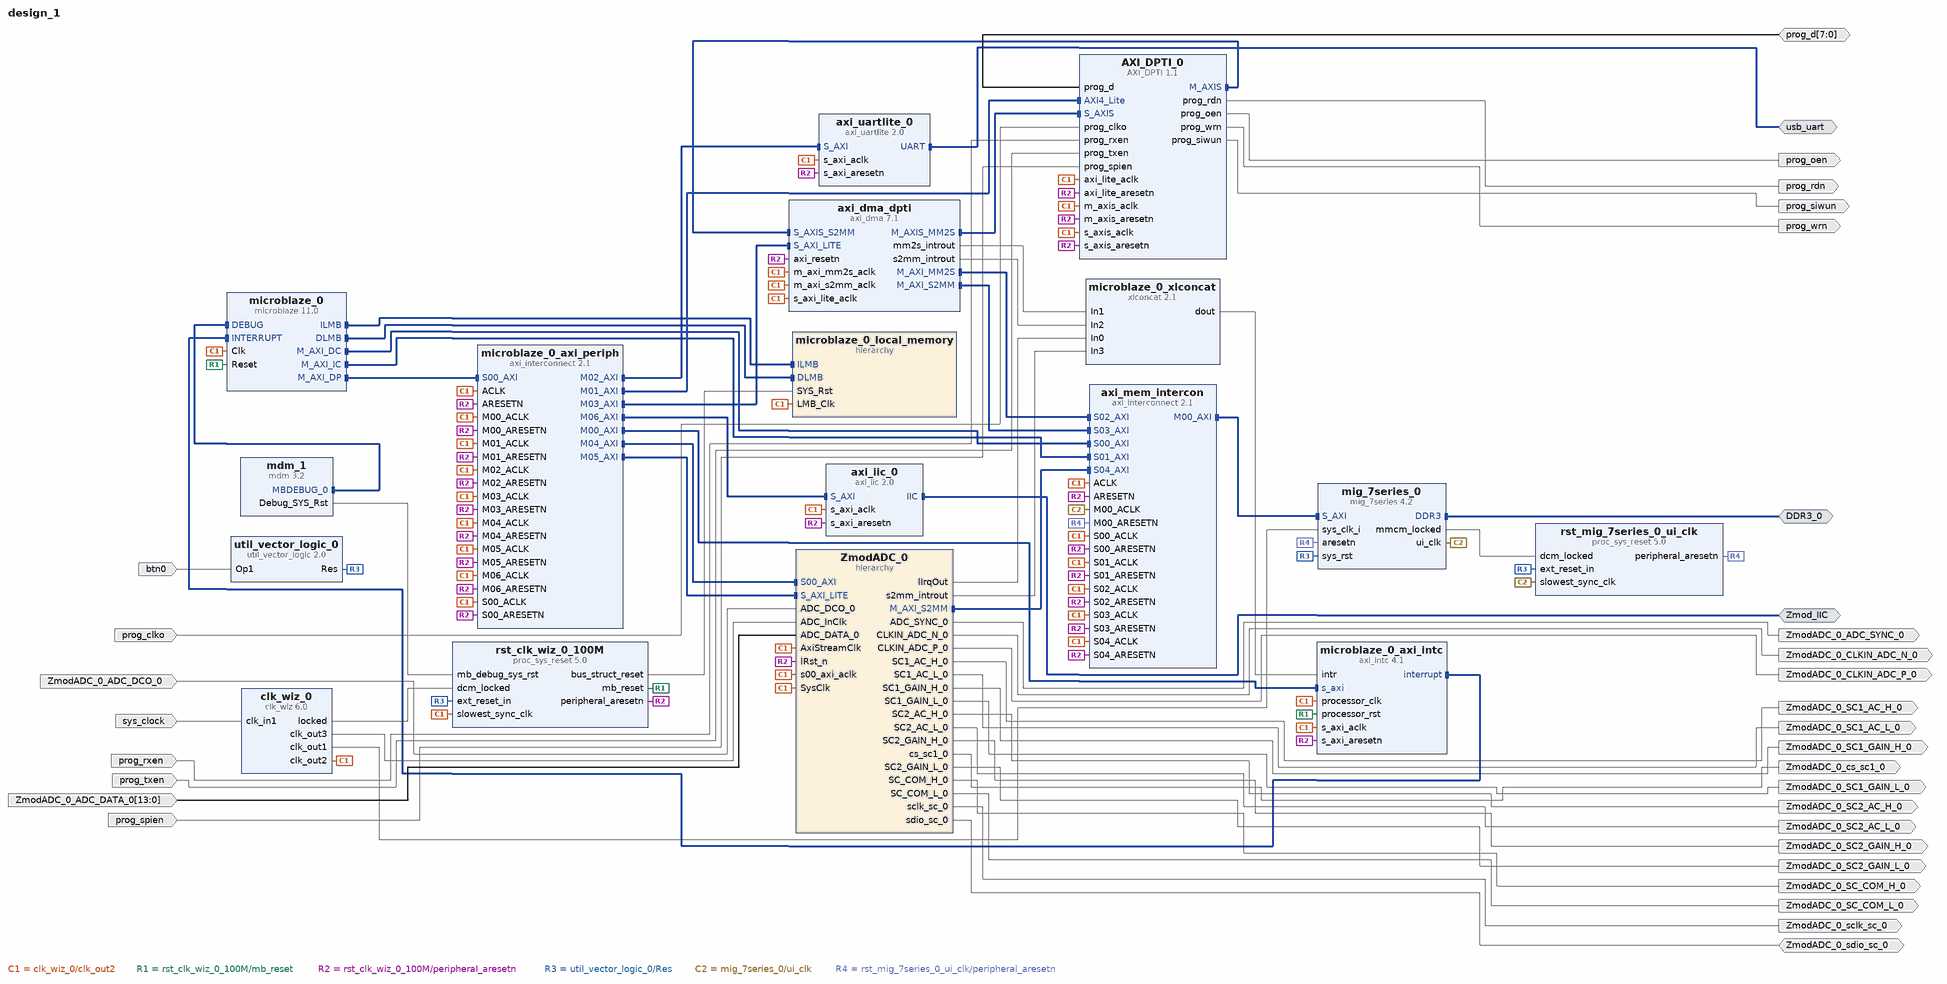
[diagram p0: block diagram of the top level]
# Vivado block design design_1, xc7a100tcsg324-1, Vivado 2019.1.3
create_bd_design design_1

create_bd_intf_port -mode Master -vlnv xilinx.com:interface:uart_rtl:1.0 usb_uart
create_bd_intf_port -mode Master -vlnv xilinx.com:interface:iic_rtl:1.0 Zmod_IIC
create_bd_intf_port -mode Master -vlnv xilinx.com:interface:ddrx_rtl:1.0 DDR3_0
create_bd_port -dir O ZmodADC_0_ADC_SYNC_0
create_bd_port -dir O ZmodADC_0_CLKIN_ADC_N_0
create_bd_port -dir O ZmodADC_0_CLKIN_ADC_P_0
create_bd_port -dir O ZmodADC_0_SC1_AC_H_0
create_bd_port -dir O ZmodADC_0_SC1_AC_L_0
create_bd_port -dir O ZmodADC_0_SC1_GAIN_H_0
create_bd_port -dir O ZmodADC_0_SC1_GAIN_L_0
create_bd_port -dir O ZmodADC_0_SC2_AC_H_0
create_bd_port -dir O ZmodADC_0_SC2_AC_L_0
create_bd_port -dir O ZmodADC_0_SC2_GAIN_H_0
create_bd_port -dir O ZmodADC_0_SC2_GAIN_L_0
create_bd_port -dir O ZmodADC_0_SC_COM_H_0
create_bd_port -dir O ZmodADC_0_SC_COM_L_0
create_bd_port -dir O ZmodADC_0_cs_sc1_0
create_bd_port -dir O ZmodADC_0_sclk_sc_0
create_bd_port -dir IO ZmodADC_0_sdio_sc_0
create_bd_port -dir I ZmodADC_0_ADC_DCO_0
create_bd_port -dir I -from 13 -to 0 ZmodADC_0_ADC_DATA_0
create_bd_port -dir O prog_rdn
create_bd_port -dir O prog_wrn
create_bd_port -dir O prog_oen
create_bd_port -dir O prog_siwun
create_bd_port -dir IO -from 7 -to 0 prog_d
create_bd_port -dir I prog_clko
create_bd_port -dir I prog_rxen
create_bd_port -dir I prog_txen
create_bd_port -dir I prog_spien
create_bd_port -dir I btn0
create_bd_port -dir I -type clk sys_clock
set_property -dict {CONFIG.FREQ_HZ 100000000 CONFIG.PHASE 0.000} [get_bd_ports sys_clock]

create_bd_cell -type ip -vlnv xilinx.com:ip:clk_wiz:6.0 clk_wiz_0
set_property -dict [list \
  CONFIG.CLKOUT1_JITTER 126.455 \
  CONFIG.CLKOUT1_PHASE_ERROR 114.212 \
  CONFIG.CLKOUT1_REQUESTED_OUT_FREQ 200.000 \
  CONFIG.CLKOUT2_JITTER 144.719 \
  CONFIG.CLKOUT2_PHASE_ERROR 114.212 \
  CONFIG.CLKOUT2_USED true \
  CONFIG.CLKOUT3_JITTER 111.164 \
  CONFIG.CLKOUT3_PHASE_ERROR 114.212 \
  CONFIG.CLKOUT3_REQUESTED_OUT_FREQ 400.000 \
  CONFIG.CLKOUT3_USED true \
  CONFIG.CLK_IN1_BOARD_INTERFACE sys_clock \
  CONFIG.MMCM_CLKFBOUT_MULT_F 8.000 \
  CONFIG.MMCM_CLKOUT0_DIVIDE_F 4.000 \
  CONFIG.MMCM_CLKOUT1_DIVIDE 8 \
  CONFIG.MMCM_CLKOUT2_DIVIDE 2 \
  CONFIG.NUM_OUT_CLKS 3 \
  CONFIG.USE_BOARD_FLOW true \
  CONFIG.USE_RESET false \
] [get_bd_cells clk_wiz_0]
create_bd_cell -type ip -vlnv xilinx.com:ip:microblaze:11.0 microblaze_0
set_property -dict [list \
  CONFIG.C_CACHE_BYTE_SIZE 8192 \
  CONFIG.C_DCACHE_BYTE_SIZE 8192 \
  CONFIG.C_DEBUG_ENABLED 1 \
  CONFIG.C_D_AXI 1 \
  CONFIG.C_D_LMB 1 \
  CONFIG.C_I_LMB 1 \
  CONFIG.C_USE_DCACHE 1 \
  CONFIG.C_USE_ICACHE 1 \
] [get_bd_cells microblaze_0]
create_bd_cell -type hier microblaze_0_local_memory
create_bd_cell -type ip -vlnv xilinx.com:ip:axi_interconnect:2.1 microblaze_0_axi_periph
set_property -dict {CONFIG.NUM_MI 7} [get_bd_cells microblaze_0_axi_periph]
create_bd_cell -type ip -vlnv xilinx.com:ip:axi_intc:4.1 microblaze_0_axi_intc
set_property -dict {CONFIG.C_HAS_FAST 1} [get_bd_cells microblaze_0_axi_intc]
create_bd_cell -type ip -vlnv xilinx.com:ip:xlconcat:2.1 microblaze_0_xlconcat
set_property -dict {CONFIG.NUM_PORTS 4} [get_bd_cells microblaze_0_xlconcat]
create_bd_cell -type ip -vlnv xilinx.com:ip:mdm:3.2 mdm_1
create_bd_cell -type ip -vlnv xilinx.com:ip:proc_sys_reset:5.0 rst_clk_wiz_0_100M
create_bd_cell -type ip -vlnv xilinx.com:ip:axi_interconnect:2.1 axi_mem_intercon
set_property -dict {CONFIG.NUM_MI 1 CONFIG.NUM_SI 5} [get_bd_cells axi_mem_intercon]
create_bd_cell -type hier ZmodADC_0
create_bd_cell -type ip -vlnv xilinx.com:ip:axi_uartlite:2.0 axi_uartlite_0
set_property -dict [list \
  CONFIG.C_BAUDRATE 115200 \
  CONFIG.UARTLITE_BOARD_INTERFACE usb_uart \
  CONFIG.USE_BOARD_FLOW true \
] [get_bd_cells axi_uartlite_0]
create_bd_cell -type ip -vlnv xilinx.com:ip:axi_dma:7.1 axi_dma_dpti
set_property -dict [list \
  CONFIG.c_include_mm2s_dre 1 \
  CONFIG.c_include_s2mm_dre 1 \
  CONFIG.c_include_sg 0 \
  CONFIG.c_sg_length_width 23 \
] [get_bd_cells axi_dma_dpti]
create_bd_cell -type ip -vlnv xilinx.com:ip:axi_iic:2.0 axi_iic_0
create_bd_cell -type ip -vlnv xilinx.com:ip:mig_7series:4.2 mig_7series_0
set_property -dict [list \
  CONFIG.BOARD_MIG_PARAM Custom \
  CONFIG.RESET_BOARD_INTERFACE Custom \
  CONFIG.XML_INPUT_FILE mig_a.prj \
] [get_bd_cells mig_7series_0]
create_bd_cell -type ip -vlnv xilinx.com:ip:proc_sys_reset:5.0 rst_mig_7series_0_ui_clk
create_bd_cell -type ip -vlnv xilinx.com:ip:util_vector_logic:2.0 util_vector_logic_0
set_property -dict {CONFIG.C_OPERATION not CONFIG.C_SIZE 1} [get_bd_cells util_vector_logic_0]
create_bd_cell -type ip -vlnv digilentinc.com:IP:AXI_DPTI:1.1 AXI_DPTI_0

# ---- hierarchy /microblaze_0_local_memory ----
current_bd_instance /microblaze_0_local_memory
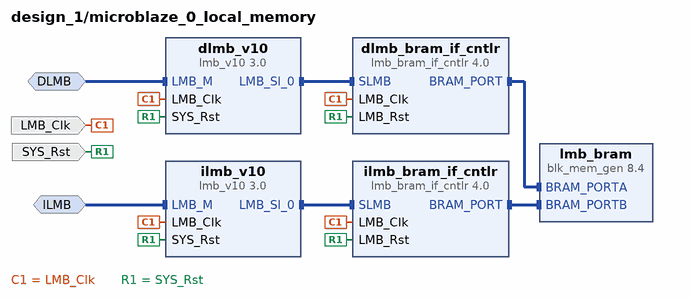
[diagram p1: block diagram inside /microblaze_0_local_memory]
create_bd_intf_pin -mode MirroredMaster -vlnv xilinx.com:interface:lmb_rtl:1.0 DLMB
create_bd_intf_pin -mode MirroredMaster -vlnv xilinx.com:interface:lmb_rtl:1.0 ILMB
create_bd_pin -dir I -type clk LMB_Clk
create_bd_pin -dir I -type rst SYS_Rst

create_bd_cell -type ip -vlnv xilinx.com:ip:lmb_v10:3.0 dlmb_v10
create_bd_cell -type ip -vlnv xilinx.com:ip:lmb_v10:3.0 ilmb_v10
create_bd_cell -type ip -vlnv xilinx.com:ip:lmb_bram_if_cntlr:4.0 dlmb_bram_if_cntlr
set_property -dict {CONFIG.C_ECC 0} [get_bd_cells dlmb_bram_if_cntlr]
create_bd_cell -type ip -vlnv xilinx.com:ip:lmb_bram_if_cntlr:4.0 ilmb_bram_if_cntlr
set_property -dict {CONFIG.C_ECC 0} [get_bd_cells ilmb_bram_if_cntlr]
create_bd_cell -type ip -vlnv xilinx.com:ip:blk_mem_gen:8.4 lmb_bram
set_property -dict {CONFIG.Memory_Type True_Dual_Port_RAM CONFIG.use_bram_block BRAM_Controller} [get_bd_cells lmb_bram]

# ---- hierarchy /ZmodADC_0 ----
current_bd_instance /ZmodADC_0
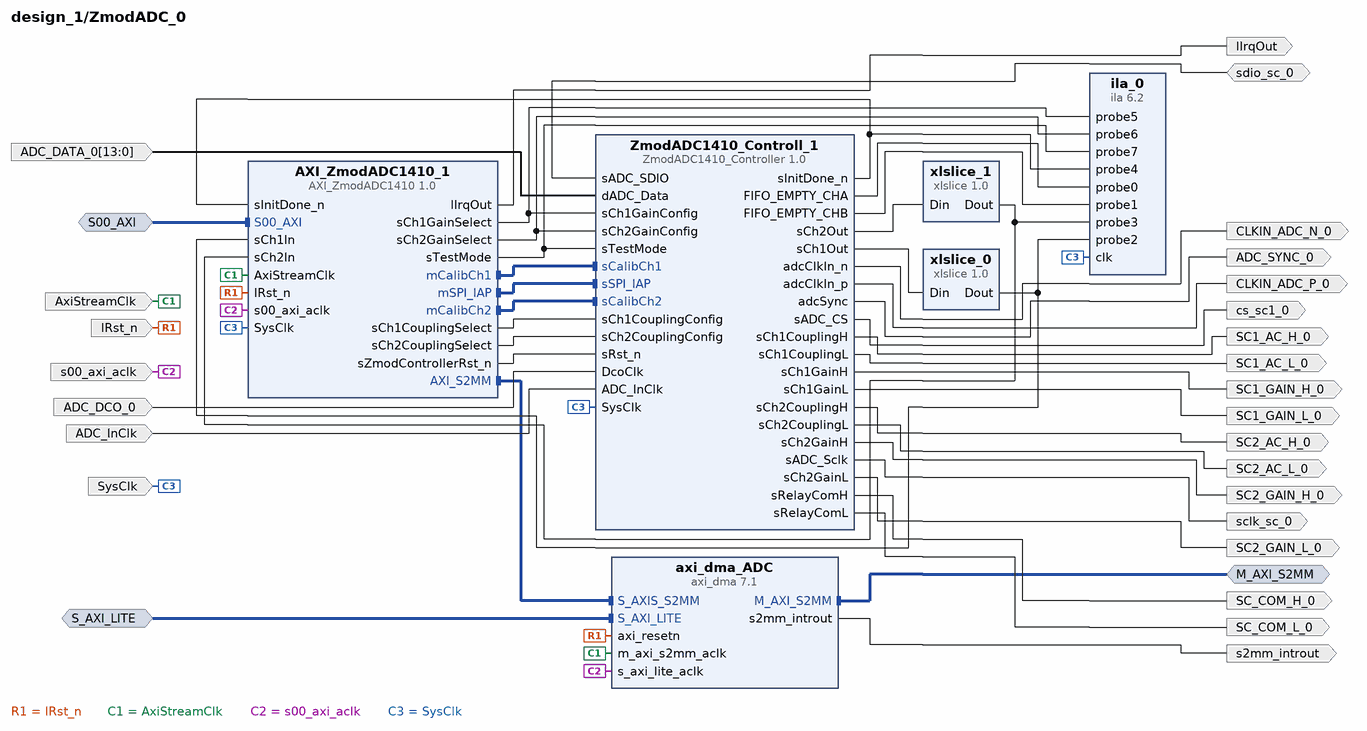
[diagram p2: block diagram inside /ZmodADC_0]
create_bd_intf_pin -mode Master -vlnv xilinx.com:interface:aximm_rtl:1.0 M_AXI_S2MM
create_bd_intf_pin -mode Slave -vlnv xilinx.com:interface:aximm_rtl:1.0 S00_AXI
create_bd_intf_pin -mode Slave -vlnv xilinx.com:interface:aximm_rtl:1.0 S_AXI_LITE
create_bd_pin -dir I -from 13 -to 0 ADC_DATA_0
create_bd_pin -dir I ADC_DCO_0
create_bd_pin -dir I -type clk ADC_InClk
create_bd_pin -dir O ADC_SYNC_0
create_bd_pin -dir I -type clk AxiStreamClk
create_bd_pin -dir O CLKIN_ADC_N_0
create_bd_pin -dir O CLKIN_ADC_P_0
create_bd_pin -dir O SC1_AC_H_0
create_bd_pin -dir O SC1_AC_L_0
create_bd_pin -dir O SC1_GAIN_H_0
create_bd_pin -dir O SC1_GAIN_L_0
create_bd_pin -dir O SC2_AC_H_0
create_bd_pin -dir O SC2_AC_L_0
create_bd_pin -dir O SC2_GAIN_H_0
create_bd_pin -dir O SC2_GAIN_L_0
create_bd_pin -dir O SC_COM_H_0
create_bd_pin -dir O SC_COM_L_0
create_bd_pin -dir I -type clk SysClk
create_bd_pin -dir O cs_sc1_0
create_bd_pin -dir O -type intr lIrqOut
create_bd_pin -dir I -type rst lRst_n
create_bd_pin -dir I -type clk s00_axi_aclk
create_bd_pin -dir O -type intr s2mm_introut
create_bd_pin -dir O sclk_sc_0
create_bd_pin -dir IO sdio_sc_0

create_bd_cell -type ip -vlnv xilinx.com:ip:axi_dma:7.1 axi_dma_ADC
set_property -dict {CONFIG.c_include_mm2s 0 CONFIG.c_include_sg 0 CONFIG.c_sg_length_width 18} [get_bd_cells axi_dma_ADC]
create_bd_cell -type ip -vlnv xilinx.com:ip:ila:6.2 ila_0
set_property -dict {CONFIG.C_ENABLE_ILA_AXI_MON false CONFIG.C_MONITOR_TYPE Native CONFIG.C_NUM_OF_PROBES 8} [get_bd_cells ila_0]
create_bd_cell -type ip -vlnv xilinx.com:ip:xlslice:1.0 xlslice_0
set_property -dict {CONFIG.DIN_FROM 15 CONFIG.DIN_TO 2 CONFIG.DIN_WIDTH 16 CONFIG.DOUT_WIDTH 14} [get_bd_cells xlslice_0]
create_bd_cell -type ip -vlnv xilinx.com:ip:xlslice:1.0 xlslice_1
set_property -dict {CONFIG.DIN_FROM 15 CONFIG.DIN_TO 2 CONFIG.DIN_WIDTH 16 CONFIG.DOUT_WIDTH 14} [get_bd_cells xlslice_1]
create_bd_cell -type ip -vlnv natinst.com:user:AXI_ZmodADC1410:1.0 AXI_ZmodADC1410_1
set_property -dict {CONFIG.kCrossRegCnt 13} [get_bd_cells AXI_ZmodADC1410_1]
create_bd_cell -type ip -vlnv xilinx.com:user:ZmodADC1410_Controller:1.0 ZmodADC1410_Controll_1
set_property -dict [list \
  CONFIG.kCh1HgMultCoefStatic {"000000000000000000"} \
  CONFIG.kCh1LgMultCoefStatic {"000000000000000000"} \
  CONFIG.kCh2HgMultCoefStatic {"000000000000000000"} \
  CONFIG.kCh2LgMultCoefStatic {"000000000000000000"} \
  CONFIG.kExtCmdInterfaceEn true \
  CONFIG.kExtRelayConfigEn true \
] [get_bd_cells ZmodADC1410_Controll_1]

# ---- connections ----

current_bd_instance /microblaze_0_local_memory
connect_bd_intf_net -intf_net microblaze_0_ilmb [get_bd_intf_pins ILMB] [get_bd_intf_pins ilmb_v10/LMB_M]
connect_bd_intf_net -intf_net microblaze_0_ilmb_cntlr [get_bd_intf_pins ilmb_bram_if_cntlr/BRAM_PORT] [get_bd_intf_pins lmb_bram/BRAM_PORTB]
connect_bd_intf_net -intf_net microblaze_0_dlmb [get_bd_intf_pins DLMB] [get_bd_intf_pins dlmb_v10/LMB_M]
connect_bd_intf_net -intf_net microblaze_0_dlmb_bus [get_bd_intf_pins dlmb_v10/LMB_Sl_0] [get_bd_intf_pins dlmb_bram_if_cntlr/SLMB]
connect_bd_intf_net -intf_net microblaze_0_dlmb_cntlr [get_bd_intf_pins dlmb_bram_if_cntlr/BRAM_PORT] [get_bd_intf_pins lmb_bram/BRAM_PORTA]
connect_bd_intf_net -intf_net microblaze_0_ilmb_bus [get_bd_intf_pins ilmb_v10/LMB_Sl_0] [get_bd_intf_pins ilmb_bram_if_cntlr/SLMB]
connect_bd_net -net microblaze_0_Clk [get_bd_pins LMB_Clk] \
  [get_bd_pins dlmb_v10/LMB_Clk] [get_bd_pins dlmb_bram_if_cntlr/LMB_Clk] [get_bd_pins ilmb_v10/LMB_Clk] \
  [get_bd_pins ilmb_bram_if_cntlr/LMB_Clk]
connect_bd_net [get_bd_pins SYS_Rst] \
  [get_bd_pins dlmb_v10/SYS_Rst] [get_bd_pins dlmb_bram_if_cntlr/LMB_Rst] [get_bd_pins ilmb_v10/SYS_Rst] \
  [get_bd_pins ilmb_bram_if_cntlr/LMB_Rst]
set_property HDL_ATTRIBUTE.BMM_INFO_ADDRESS_SPACE {byte  0x00000000 32 > design_1 microblaze_0_local_memory/lmb_bram} [get_bd_cells dlmb_bram_if_cntlr]
set_property HDL_ATTRIBUTE.KEEP_HIERARCHY yes [get_bd_cells dlmb_bram_if_cntlr]

current_bd_instance /ZmodADC_0
connect_bd_intf_net -intf_net axi_dma_0_M_AXI_S2MM [get_bd_intf_pins M_AXI_S2MM] [get_bd_intf_pins axi_dma_ADC/M_AXI_S2MM]
connect_bd_intf_net [get_bd_intf_pins S00_AXI] [get_bd_intf_pins AXI_ZmodADC1410_1/S00_AXI]
connect_bd_intf_net [get_bd_intf_pins AXI_ZmodADC1410_1/mCalibCh1] [get_bd_intf_pins ZmodADC1410_Controll_1/sCalibCh1]
connect_bd_intf_net [get_bd_intf_pins S_AXI_LITE] [get_bd_intf_pins axi_dma_ADC/S_AXI_LITE]
connect_bd_intf_net [get_bd_intf_pins AXI_ZmodADC1410_1/AXI_S2MM] [get_bd_intf_pins axi_dma_ADC/S_AXIS_S2MM]
connect_bd_intf_net -intf_net AXI_ZmodADC1410_1_mSPI [get_bd_intf_pins AXI_ZmodADC1410_1/mSPI_IAP] [get_bd_intf_pins ZmodADC1410_Controll_1/sSPI_IAP]
connect_bd_intf_net [get_bd_intf_pins AXI_ZmodADC1410_1/mCalibCh2] [get_bd_intf_pins ZmodADC1410_Controll_1/sCalibCh2]
connect_bd_net -net ADC_DATA_0_1 [get_bd_pins ADC_DATA_0] [get_bd_pins ZmodADC1410_Controll_1/dADC_Data]
connect_bd_net -net ADC_DCO_0_1 [get_bd_pins ADC_DCO_0] [get_bd_pins ZmodADC1410_Controll_1/DcoClk]
connect_bd_net [get_bd_pins AXI_ZmodADC1410_1/lIrqOut] [get_bd_pins lIrqOut]
connect_bd_net [get_bd_pins AXI_ZmodADC1410_1/sCh1CouplingSelect] [get_bd_pins ZmodADC1410_Controll_1/sCh1CouplingConfig]
connect_bd_net [get_bd_pins AXI_ZmodADC1410_1/sCh1GainSelect] [get_bd_pins ila_0/probe5] [get_bd_pins ZmodADC1410_Controll_1/sCh1GainConfig]
connect_bd_net [get_bd_pins AXI_ZmodADC1410_1/sCh2CouplingSelect] [get_bd_pins ZmodADC1410_Controll_1/sCh2CouplingConfig]
connect_bd_net [get_bd_pins AXI_ZmodADC1410_1/sCh2GainSelect] [get_bd_pins ila_0/probe6] [get_bd_pins ZmodADC1410_Controll_1/sCh2GainConfig]
connect_bd_net [get_bd_pins AXI_ZmodADC1410_1/sTestMode] [get_bd_pins ila_0/probe7] [get_bd_pins ZmodADC1410_Controll_1/sTestMode]
connect_bd_net [get_bd_pins AXI_ZmodADC1410_1/sZmodControllerRst_n] [get_bd_pins ZmodADC1410_Controll_1/sRst_n]
connect_bd_net [get_bd_pins sdio_sc_0] [get_bd_pins ZmodADC1410_Controll_1/sADC_SDIO]
connect_bd_net -net S00_ARESETN_1 [get_bd_pins lRst_n] [get_bd_pins axi_dma_ADC/axi_resetn] [get_bd_pins AXI_ZmodADC1410_1/lRst_n]
connect_bd_net -net ZmodADC1410_Controll_0_CALIB_DONE_N [get_bd_pins ZmodADC1410_Controll_1/sInitDone_n] \
  [get_bd_pins ila_0/probe4] [get_bd_pins AXI_ZmodADC1410_1/sInitDone_n]
connect_bd_net [get_bd_pins ZmodADC1410_Controll_1/FIFO_EMPTY_CHA] [get_bd_pins ila_0/probe0]
connect_bd_net [get_bd_pins ZmodADC1410_Controll_1/FIFO_EMPTY_CHB] [get_bd_pins ila_0/probe1]
connect_bd_net [get_bd_pins ZmodADC1410_Controll_1/adcClkIn_n] [get_bd_pins CLKIN_ADC_N_0]
connect_bd_net [get_bd_pins ZmodADC1410_Controll_1/adcClkIn_p] [get_bd_pins CLKIN_ADC_P_0]
connect_bd_net [get_bd_pins ZmodADC1410_Controll_1/adcSync] [get_bd_pins ADC_SYNC_0]
connect_bd_net [get_bd_pins ZmodADC1410_Controll_1/sADC_CS] [get_bd_pins cs_sc1_0]
connect_bd_net [get_bd_pins ZmodADC1410_Controll_1/sADC_Sclk] [get_bd_pins sclk_sc_0]
connect_bd_net [get_bd_pins ZmodADC1410_Controll_1/sCh1CouplingH] [get_bd_pins SC1_AC_H_0]
connect_bd_net [get_bd_pins ZmodADC1410_Controll_1/sCh1CouplingL] [get_bd_pins SC1_AC_L_0]
connect_bd_net [get_bd_pins ZmodADC1410_Controll_1/sCh1GainH] [get_bd_pins SC1_GAIN_H_0]
connect_bd_net [get_bd_pins ZmodADC1410_Controll_1/sCh1GainL] [get_bd_pins SC1_GAIN_L_0]
connect_bd_net [get_bd_pins ZmodADC1410_Controll_1/sCh1Out] [get_bd_pins xlslice_0/Din]
connect_bd_net [get_bd_pins ZmodADC1410_Controll_1/sCh2CouplingH] [get_bd_pins SC2_AC_H_0]
connect_bd_net [get_bd_pins ZmodADC1410_Controll_1/sCh2CouplingL] [get_bd_pins SC2_AC_L_0]
connect_bd_net [get_bd_pins ZmodADC1410_Controll_1/sCh2GainH] [get_bd_pins SC2_GAIN_H_0]
connect_bd_net [get_bd_pins ZmodADC1410_Controll_1/sCh2GainL] [get_bd_pins SC2_GAIN_L_0]
connect_bd_net [get_bd_pins ZmodADC1410_Controll_1/sCh2Out] [get_bd_pins xlslice_1/Din]
connect_bd_net [get_bd_pins ZmodADC1410_Controll_1/sRelayComH] [get_bd_pins SC_COM_H_0]
connect_bd_net [get_bd_pins ZmodADC1410_Controll_1/sRelayComL] [get_bd_pins SC_COM_L_0]
connect_bd_net -net axi_dma_0_s2mm_introut [get_bd_pins axi_dma_ADC/s2mm_introut] [get_bd_pins s2mm_introut]
connect_bd_net -net clk_wiz_0_clk_out1 [get_bd_pins AxiStreamClk] \
  [get_bd_pins axi_dma_ADC/m_axi_s2mm_aclk] [get_bd_pins AXI_ZmodADC1410_1/AxiStreamClk]
connect_bd_net -net clk_wiz_0_clk_out2 [get_bd_pins s00_axi_aclk] \
  [get_bd_pins axi_dma_ADC/s_axi_lite_aclk] [get_bd_pins AXI_ZmodADC1410_1/s00_axi_aclk]
connect_bd_net -net clk_wiz_0_clk_out4 [get_bd_pins ADC_InClk] [get_bd_pins ZmodADC1410_Controll_1/ADC_InClk]
connect_bd_net -net processing_system7_0_FCLK_CLK0 [get_bd_pins SysClk] \
  [get_bd_pins ila_0/clk] [get_bd_pins AXI_ZmodADC1410_1/SysClk] [get_bd_pins ZmodADC1410_Controll_1/SysClk]
connect_bd_net [get_bd_pins xlslice_0/Dout] [get_bd_pins ila_0/probe2] [get_bd_pins AXI_ZmodADC1410_1/sCh1In]
connect_bd_net [get_bd_pins xlslice_1/Dout] [get_bd_pins ila_0/probe3] [get_bd_pins AXI_ZmodADC1410_1/sCh2In]

current_bd_instance /
connect_bd_intf_net [get_bd_intf_ports DDR3_0] [get_bd_intf_pins mig_7series_0/DDR3]
connect_bd_intf_net [get_bd_intf_pins microblaze_0_axi_periph/M01_AXI] [get_bd_intf_pins AXI_DPTI_0/AXI4_Lite]
connect_bd_intf_net [get_bd_intf_pins microblaze_0_axi_periph/M04_AXI] [get_bd_intf_pins ZmodADC_0/S00_AXI]
connect_bd_intf_net [get_bd_intf_pins microblaze_0/ILMB] [get_bd_intf_pins microblaze_0_local_memory/ILMB]
connect_bd_intf_net -intf_net microblaze_0_intc_axi [get_bd_intf_pins microblaze_0_axi_periph/M00_AXI] [get_bd_intf_pins microblaze_0_axi_intc/s_axi]
connect_bd_intf_net [get_bd_intf_pins microblaze_0/M_AXI_DC] [get_bd_intf_pins axi_mem_intercon/S00_AXI]
connect_bd_intf_net [get_bd_intf_pins microblaze_0_axi_periph/M06_AXI] [get_bd_intf_pins axi_iic_0/S_AXI]
connect_bd_intf_net [get_bd_intf_pins microblaze_0_axi_periph/M05_AXI] [get_bd_intf_pins ZmodADC_0/S_AXI_LITE]
connect_bd_intf_net [get_bd_intf_pins microblaze_0/DLMB] [get_bd_intf_pins microblaze_0_local_memory/DLMB]
connect_bd_intf_net [get_bd_intf_pins microblaze_0_axi_intc/interrupt] [get_bd_intf_pins microblaze_0/INTERRUPT]
connect_bd_intf_net [get_bd_intf_pins axi_mem_intercon/M00_AXI] [get_bd_intf_pins mig_7series_0/S_AXI]
connect_bd_intf_net [get_bd_intf_ports usb_uart] [get_bd_intf_pins axi_uartlite_0/UART]
connect_bd_intf_net [get_bd_intf_pins microblaze_0/M_AXI_IC] [get_bd_intf_pins axi_mem_intercon/S01_AXI]
connect_bd_intf_net [get_bd_intf_pins ZmodADC_0/M_AXI_S2MM] [get_bd_intf_pins axi_mem_intercon/S04_AXI]
connect_bd_intf_net [get_bd_intf_pins mdm_1/MBDEBUG_0] [get_bd_intf_pins microblaze_0/DEBUG]
connect_bd_intf_net [get_bd_intf_pins axi_dma_dpti/M_AXIS_MM2S] [get_bd_intf_pins AXI_DPTI_0/S_AXIS]
connect_bd_intf_net [get_bd_intf_pins microblaze_0_axi_periph/M02_AXI] [get_bd_intf_pins axi_uartlite_0/S_AXI]
connect_bd_intf_net -intf_net microblaze_0_axi_dp [get_bd_intf_pins microblaze_0_axi_periph/S00_AXI] [get_bd_intf_pins microblaze_0/M_AXI_DP]
connect_bd_intf_net [get_bd_intf_pins microblaze_0_axi_periph/M03_AXI] [get_bd_intf_pins axi_dma_dpti/S_AXI_LITE]
connect_bd_intf_net [get_bd_intf_pins axi_dma_dpti/M_AXI_MM2S] [get_bd_intf_pins axi_mem_intercon/S02_AXI]
connect_bd_intf_net [get_bd_intf_pins axi_dma_dpti/M_AXI_S2MM] [get_bd_intf_pins axi_mem_intercon/S03_AXI]
connect_bd_intf_net [get_bd_intf_ports Zmod_IIC] [get_bd_intf_pins axi_iic_0/IIC]
connect_bd_intf_net [get_bd_intf_pins AXI_DPTI_0/M_AXIS] [get_bd_intf_pins axi_dma_dpti/S_AXIS_S2MM]
connect_bd_net -net microblaze_0_intr [get_bd_pins microblaze_0_xlconcat/dout] [get_bd_pins microblaze_0_axi_intc/intr]
connect_bd_net -net microblaze_0_Clk [get_bd_pins clk_wiz_0/clk_out2] \
  [get_bd_pins microblaze_0/Clk] [get_bd_pins microblaze_0_axi_periph/ACLK] [get_bd_pins microblaze_0_axi_periph/S00_ACLK] \
  [get_bd_pins microblaze_0_axi_periph/M00_ACLK] [get_bd_pins microblaze_0_axi_intc/s_axi_aclk] \
  [get_bd_pins microblaze_0_axi_intc/processor_clk] [get_bd_pins microblaze_0_local_memory/LMB_Clk] \
  [get_bd_pins rst_clk_wiz_0_100M/slowest_sync_clk] [get_bd_pins axi_mem_intercon/S00_ACLK] \
  [get_bd_pins axi_mem_intercon/ACLK] [get_bd_pins axi_mem_intercon/S01_ACLK] [get_bd_pins microblaze_0_axi_periph/M01_ACLK] \
  [get_bd_pins axi_uartlite_0/s_axi_aclk] [get_bd_pins microblaze_0_axi_periph/M02_ACLK] \
  [get_bd_pins axi_dma_dpti/s_axi_lite_aclk] [get_bd_pins microblaze_0_axi_periph/M03_ACLK] \
  [get_bd_pins ZmodADC_0/s00_axi_aclk] [get_bd_pins microblaze_0_axi_periph/M04_ACLK] \
  [get_bd_pins microblaze_0_axi_periph/M05_ACLK] [get_bd_pins ZmodADC_0/SysClk] [get_bd_pins axi_iic_0/s_axi_aclk] \
  [get_bd_pins microblaze_0_axi_periph/M06_ACLK] [get_bd_pins axi_mem_intercon/S02_ACLK] \
  [get_bd_pins axi_dma_dpti/m_axi_mm2s_aclk] [get_bd_pins axi_mem_intercon/S03_ACLK] \
  [get_bd_pins axi_dma_dpti/m_axi_s2mm_aclk] [get_bd_pins axi_mem_intercon/S04_ACLK] [get_bd_pins ZmodADC_0/AxiStreamClk] \
  [get_bd_pins AXI_DPTI_0/m_axis_aclk] [get_bd_pins AXI_DPTI_0/s_axis_aclk] [get_bd_pins AXI_DPTI_0/axi_lite_aclk]
connect_bd_net [get_bd_pins clk_wiz_0/locked] [get_bd_pins rst_clk_wiz_0_100M/dcm_locked]
connect_bd_net [get_bd_pins rst_clk_wiz_0_100M/mb_reset] [get_bd_pins microblaze_0/Reset] [get_bd_pins microblaze_0_axi_intc/processor_rst]
connect_bd_net [get_bd_pins rst_clk_wiz_0_100M/bus_struct_reset] [get_bd_pins microblaze_0_local_memory/SYS_Rst]
connect_bd_net [get_bd_pins rst_clk_wiz_0_100M/peripheral_aresetn] \
  [get_bd_pins microblaze_0_axi_periph/ARESETN] [get_bd_pins microblaze_0_axi_periph/S00_ARESETN] \
  [get_bd_pins microblaze_0_axi_periph/M00_ARESETN] [get_bd_pins microblaze_0_axi_intc/s_axi_aresetn] \
  [get_bd_pins axi_mem_intercon/S00_ARESETN] [get_bd_pins axi_mem_intercon/ARESETN] \
  [get_bd_pins microblaze_0_axi_periph/M01_ARESETN] [get_bd_pins axi_uartlite_0/s_axi_aresetn] \
  [get_bd_pins microblaze_0_axi_periph/M02_ARESETN] [get_bd_pins axi_dma_dpti/axi_resetn] \
  [get_bd_pins microblaze_0_axi_periph/M03_ARESETN] [get_bd_pins ZmodADC_0/lRst_n] \
  [get_bd_pins microblaze_0_axi_periph/M04_ARESETN] [get_bd_pins microblaze_0_axi_periph/M05_ARESETN] \
  [get_bd_pins axi_iic_0/s_axi_aresetn] [get_bd_pins microblaze_0_axi_periph/M06_ARESETN] \
  [get_bd_pins axi_mem_intercon/S01_ARESETN] [get_bd_pins axi_mem_intercon/S02_ARESETN] \
  [get_bd_pins axi_mem_intercon/S03_ARESETN] [get_bd_pins axi_mem_intercon/S04_ARESETN] \
  [get_bd_pins AXI_DPTI_0/m_axis_aresetn] [get_bd_pins AXI_DPTI_0/s_axis_aresetn] [get_bd_pins AXI_DPTI_0/axi_lite_aresetn]
connect_bd_net [get_bd_pins mdm_1/Debug_SYS_Rst] [get_bd_pins rst_clk_wiz_0_100M/mb_debug_sys_rst]
connect_bd_net [get_bd_pins ZmodADC_0/ADC_SYNC_0] [get_bd_ports ZmodADC_0_ADC_SYNC_0]
connect_bd_net [get_bd_pins ZmodADC_0/CLKIN_ADC_N_0] [get_bd_ports ZmodADC_0_CLKIN_ADC_N_0]
connect_bd_net [get_bd_pins ZmodADC_0/CLKIN_ADC_P_0] [get_bd_ports ZmodADC_0_CLKIN_ADC_P_0]
connect_bd_net [get_bd_pins ZmodADC_0/SC1_AC_H_0] [get_bd_ports ZmodADC_0_SC1_AC_H_0]
connect_bd_net [get_bd_pins ZmodADC_0/SC1_AC_L_0] [get_bd_ports ZmodADC_0_SC1_AC_L_0]
connect_bd_net [get_bd_pins ZmodADC_0/SC1_GAIN_H_0] [get_bd_ports ZmodADC_0_SC1_GAIN_H_0]
connect_bd_net [get_bd_pins ZmodADC_0/SC1_GAIN_L_0] [get_bd_ports ZmodADC_0_SC1_GAIN_L_0]
connect_bd_net [get_bd_pins ZmodADC_0/SC2_AC_H_0] [get_bd_ports ZmodADC_0_SC2_AC_H_0]
connect_bd_net [get_bd_pins ZmodADC_0/SC2_AC_L_0] [get_bd_ports ZmodADC_0_SC2_AC_L_0]
connect_bd_net [get_bd_pins ZmodADC_0/SC2_GAIN_H_0] [get_bd_ports ZmodADC_0_SC2_GAIN_H_0]
connect_bd_net [get_bd_pins ZmodADC_0/SC2_GAIN_L_0] [get_bd_ports ZmodADC_0_SC2_GAIN_L_0]
connect_bd_net [get_bd_pins ZmodADC_0/SC_COM_H_0] [get_bd_ports ZmodADC_0_SC_COM_H_0]
connect_bd_net [get_bd_pins ZmodADC_0/SC_COM_L_0] [get_bd_ports ZmodADC_0_SC_COM_L_0]
connect_bd_net [get_bd_pins ZmodADC_0/cs_sc1_0] [get_bd_ports ZmodADC_0_cs_sc1_0]
connect_bd_net [get_bd_pins ZmodADC_0/sclk_sc_0] [get_bd_ports ZmodADC_0_sclk_sc_0]
connect_bd_net [get_bd_ports ZmodADC_0_sdio_sc_0] [get_bd_pins ZmodADC_0/sdio_sc_0]
connect_bd_net -net ZmodADC_0_ADC_DCO_0_1 [get_bd_ports ZmodADC_0_ADC_DCO_0] [get_bd_pins ZmodADC_0/ADC_DCO_0]
connect_bd_net -net ZmodADC_0_ADC_DATA_0_1 [get_bd_ports ZmodADC_0_ADC_DATA_0] [get_bd_pins ZmodADC_0/ADC_DATA_0]
connect_bd_net [get_bd_pins AXI_DPTI_0/prog_rdn] [get_bd_ports prog_rdn]
connect_bd_net [get_bd_pins AXI_DPTI_0/prog_wrn] [get_bd_ports prog_wrn]
connect_bd_net [get_bd_pins AXI_DPTI_0/prog_oen] [get_bd_ports prog_oen]
connect_bd_net [get_bd_pins AXI_DPTI_0/prog_siwun] [get_bd_ports prog_siwun]
connect_bd_net [get_bd_ports prog_d] [get_bd_pins AXI_DPTI_0/prog_d]
connect_bd_net -net prog_clko_0_1 [get_bd_ports prog_clko] [get_bd_pins AXI_DPTI_0/prog_clko]
connect_bd_net -net prog_rxen_0_1 [get_bd_ports prog_rxen] [get_bd_pins AXI_DPTI_0/prog_rxen]
connect_bd_net -net prog_txen_0_1 [get_bd_ports prog_txen] [get_bd_pins AXI_DPTI_0/prog_txen]
connect_bd_net -net prog_spien_0_1 [get_bd_ports prog_spien] [get_bd_pins AXI_DPTI_0/prog_spien]
connect_bd_net -net btn0_1 [get_bd_pins util_vector_logic_0/Res] \
  [get_bd_pins rst_clk_wiz_0_100M/ext_reset_in] [get_bd_pins rst_mig_7series_0_ui_clk/ext_reset_in] \
  [get_bd_pins mig_7series_0/sys_rst]
connect_bd_net [get_bd_pins ZmodADC_0/lIrqOut] [get_bd_pins microblaze_0_xlconcat/In0]
connect_bd_net [get_bd_pins axi_dma_dpti/mm2s_introut] [get_bd_pins microblaze_0_xlconcat/In1]
connect_bd_net [get_bd_pins axi_dma_dpti/s2mm_introut] [get_bd_pins microblaze_0_xlconcat/In2]
connect_bd_net [get_bd_pins clk_wiz_0/clk_out3] [get_bd_pins ZmodADC_0/ADC_InClk]
connect_bd_net [get_bd_ports sys_clock] [get_bd_pins clk_wiz_0/clk_in1]
connect_bd_net [get_bd_pins clk_wiz_0/clk_out1] [get_bd_pins mig_7series_0/sys_clk_i]
connect_bd_net [get_bd_pins mig_7series_0/ui_clk] [get_bd_pins axi_mem_intercon/M00_ACLK] [get_bd_pins rst_mig_7series_0_ui_clk/slowest_sync_clk]
connect_bd_net [get_bd_pins mig_7series_0/mmcm_locked] [get_bd_pins rst_mig_7series_0_ui_clk/dcm_locked]
connect_bd_net [get_bd_pins rst_mig_7series_0_ui_clk/peripheral_aresetn] \
  [get_bd_pins axi_mem_intercon/M00_ARESETN] [get_bd_pins mig_7series_0/aresetn]
connect_bd_net [get_bd_pins ZmodADC_0/s2mm_introut] [get_bd_pins microblaze_0_xlconcat/In3]
connect_bd_net -net btn0_2 [get_bd_ports btn0] [get_bd_pins util_vector_logic_0/Op1]
set_property HDL_ATTRIBUTE.BMM_INFO_PROCESSOR {microblaze-le > design_1 microblaze_0_local_memory/dlmb_bram_if_cntlr} [get_bd_cells microblaze_0]
set_property HDL_ATTRIBUTE.KEEP_HIERARCHY yes [get_bd_cells microblaze_0]

# ---- address map ----
assign_bd_address -offset 0x80000000 -range 512M -target_address_space [get_bd_addr_spaces axi_dma_dpti/Data_MM2S] [get_bd_addr_segs mig_7series_0/memmap/memaddr]
assign_bd_address -offset 0x80000000 -range 512M -target_address_space [get_bd_addr_spaces axi_dma_dpti/Data_S2MM] [get_bd_addr_segs mig_7series_0/memmap/memaddr]
assign_bd_address -offset 0x00000000 -range 32K -target_address_space [get_bd_addr_spaces microblaze_0/Data] [get_bd_addr_segs microblaze_0_local_memory/dlmb_bram_if_cntlr/SLMB/Mem]
assign_bd_address -offset 0x40600000 -range 64K -target_address_space [get_bd_addr_spaces microblaze_0/Data] [get_bd_addr_segs axi_uartlite_0/S_AXI/Reg]
assign_bd_address -offset 0x40800000 -range 64K -target_address_space [get_bd_addr_spaces microblaze_0/Data] [get_bd_addr_segs axi_iic_0/S_AXI/Reg]
assign_bd_address -offset 0x41200000 -range 64K -target_address_space [get_bd_addr_spaces microblaze_0/Data] [get_bd_addr_segs microblaze_0_axi_intc/S_AXI/Reg]
assign_bd_address -offset 0x41E00000 -range 64K -target_address_space [get_bd_addr_spaces microblaze_0/Data] [get_bd_addr_segs axi_dma_dpti/S_AXI_LITE/Reg]
assign_bd_address -offset 0x41E10000 -range 64K -target_address_space [get_bd_addr_spaces microblaze_0/Data] [get_bd_addr_segs ZmodADC_0/axi_dma_ADC/S_AXI_LITE/Reg]
assign_bd_address -offset 0x44A00000 -range 64K -target_address_space [get_bd_addr_spaces microblaze_0/Data] [get_bd_addr_segs AXI_DPTI_0/AXI4_Lite/AXI4_Lite_reg]
assign_bd_address -offset 0x44A10000 -range 64K -target_address_space [get_bd_addr_spaces microblaze_0/Data] [get_bd_addr_segs ZmodADC_0/AXI_ZmodADC1410_1/S00_AXI/S00_AXI_reg]
assign_bd_address -offset 0x80000000 -range 512M -target_address_space [get_bd_addr_spaces microblaze_0/Data] [get_bd_addr_segs mig_7series_0/memmap/memaddr]
assign_bd_address -offset 0x00000000 -range 128K -target_address_space [get_bd_addr_spaces microblaze_0/Instruction] [get_bd_addr_segs microblaze_0_local_memory/ilmb_bram_if_cntlr/SLMB/Mem]
assign_bd_address -offset 0x80000000 -range 512M -target_address_space [get_bd_addr_spaces microblaze_0/Instruction] [get_bd_addr_segs mig_7series_0/memmap/memaddr]
assign_bd_address -offset 0x80000000 -range 512M -target_address_space [get_bd_addr_spaces ZmodADC_0/axi_dma_ADC/Data_S2MM] [get_bd_addr_segs mig_7series_0/memmap/memaddr]

validate_bd_design
save_bd_design
